# EAGLE design untitled (EAGLE 9.6.2)
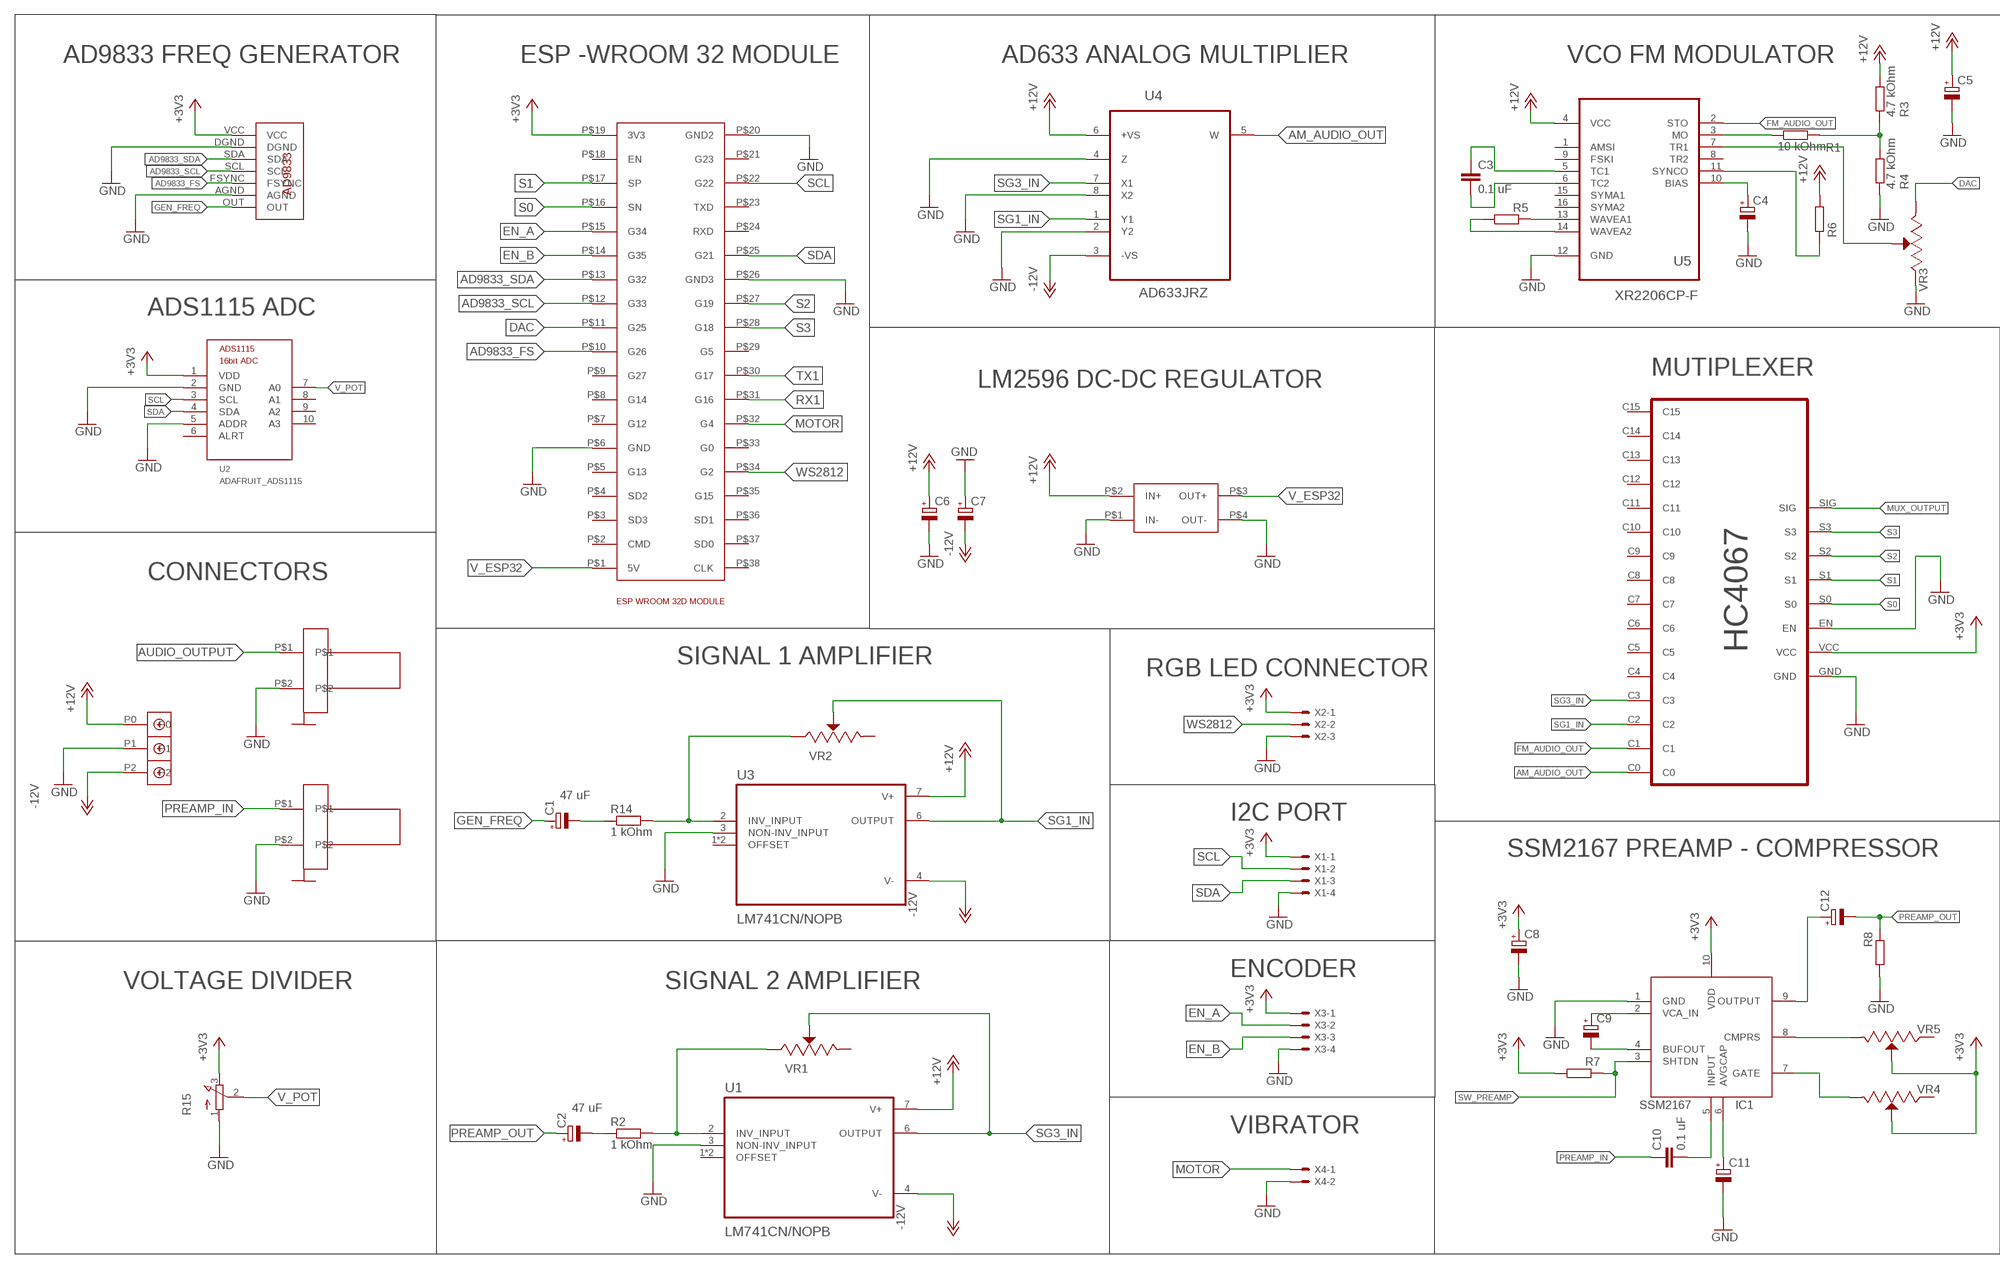
[diagram p0: schematic, sheet 1, part 1 of 2]
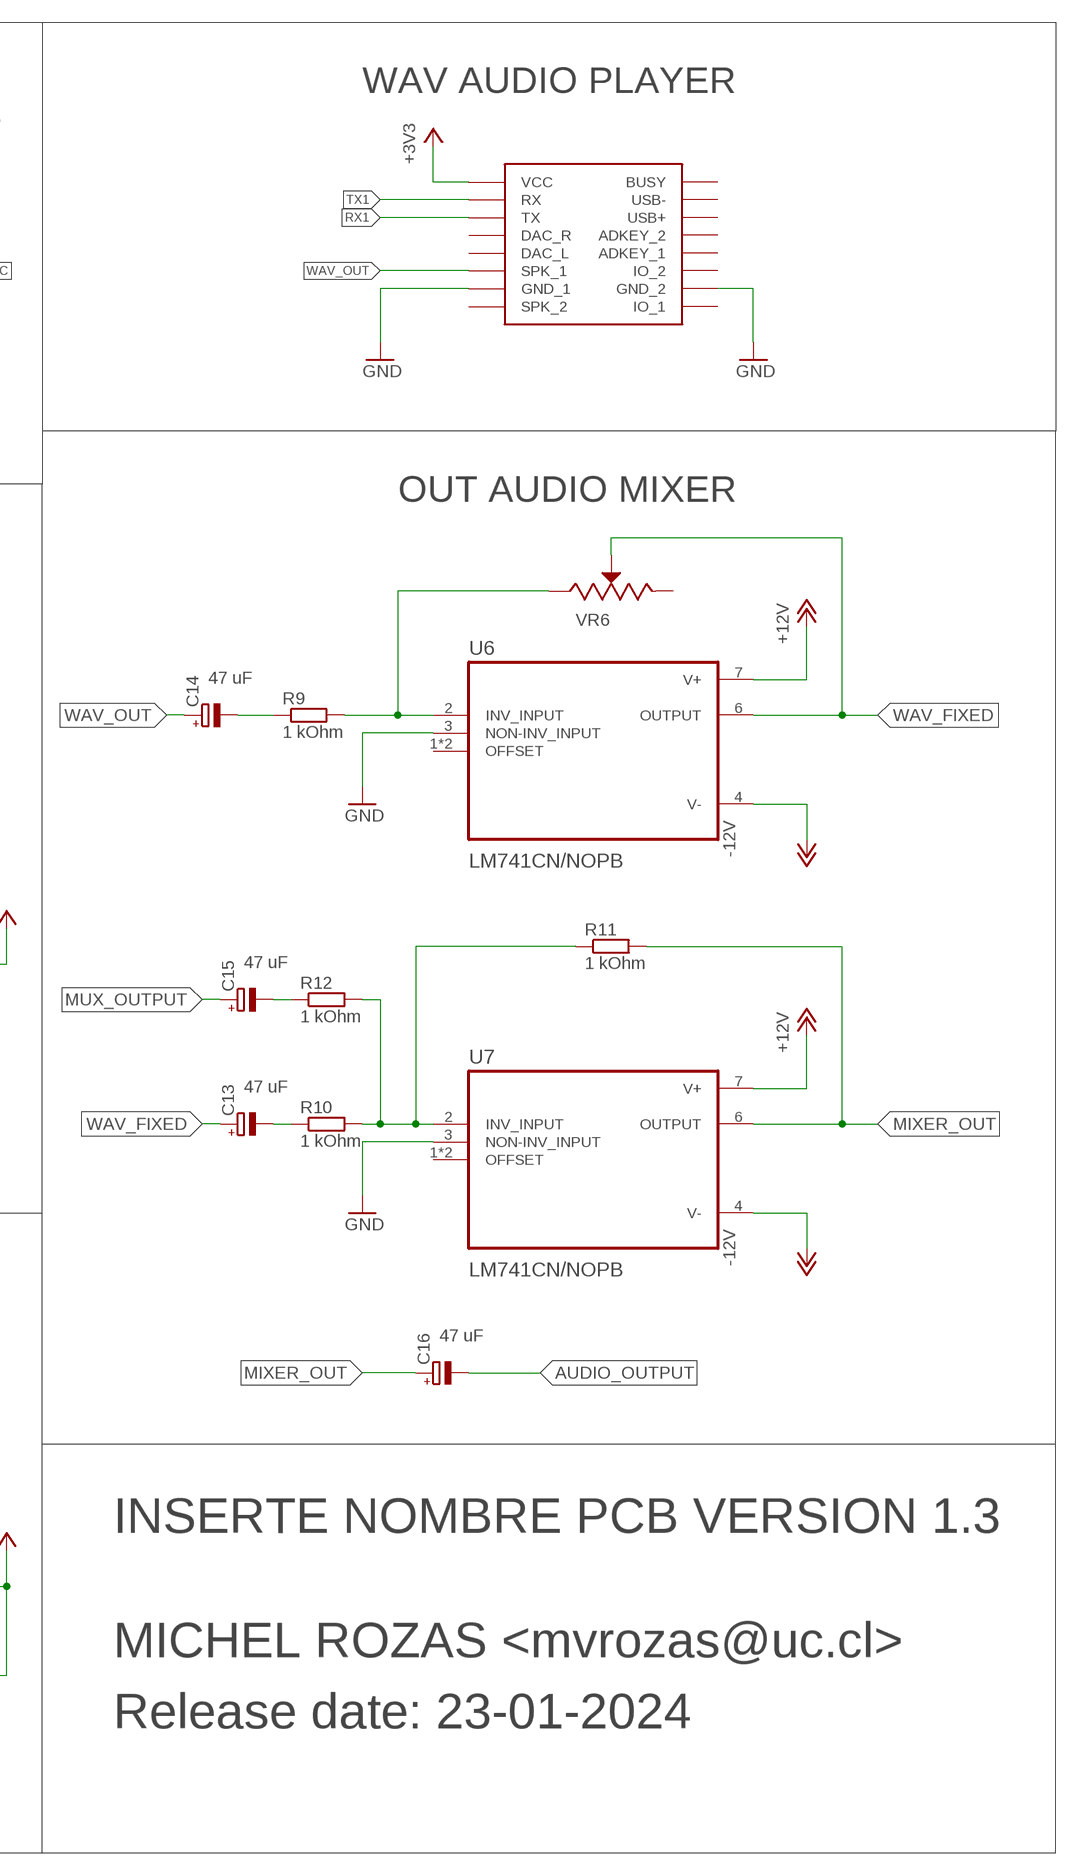
[diagram p1: schematic, sheet 1, part 2 of 2]

## Parts
C1  47 uF  CPOL-EUE1.8-4  [E1,8-4]
C2  47 uF  CPOL-EUE1.8-4  [E1,8-4]
C3  0.1 uF  C-EU050-030X075  [C050-030X075]
C4  1 uF  CPOL-EUE1.8-4  [E1,8-4]
C5  1 uF  CPOL-EUE1.8-4  [E1,8-4]
C6  100 uF  CPOL-EUE1.8-4  [E1,8-4]
C7  100 uF  CPOL-EUE1.8-4  [E1,8-4]
C8  10 uF  CPOL-EUE1.8-4  [E1,8-4]
C9  10 uF  CPOL-EUE1.8-4  [E1,8-4]
C10  0.1 uF  C-EU050-030X075  [C050-030X075]
C11  10 uF  CPOL-EUE1.8-4  [E1,8-4]
C12  10 uF  CPOL-EUE1.8-4  [E1,8-4]
C13  47 uF  CPOL-EUE1.8-4  [E1,8-4]
C14  47 uF  CPOL-EUE1.8-4  [E1,8-4]
C15  47 uF  CPOL-EUE1.8-4  [E1,8-4]
C16  47 uF  CPOL-EUE1.8-4  [E1,8-4]
IC1  SSM2167  [MSOP10]
R1  10 kOhm  R-EU_0204/7  [0204/7]
R2  1 kOhm  R-EU_0204/7  [0204/7]
R3  4.7 kOhm  R-EU_0204/7  [0204/7]
R4  4.7 kOhm  R-EU_0204/7  [0204/7]
R5  200 Ohm  R-EU_0204/7  [0204/7]
R6  10 kOhm  R-EU_0204/7  [0204/7]
R7  500 kOhm  R-EU_0204/7  [0204/7]
R8  100 kOhm  R-EU_0204/7  [0204/7]
R9  1 kOhm  R-EU_0204/7  [0204/7]
R10  1 kOhm  R-EU_0204/7  [0204/7]
R11  1 kOhm  R-EU_0204/7  [0204/7]
R12  1 kOhm  R-EU_0204/7  [0204/7]
R14  1 kOhm  R-EU_0204/7  [0204/7]
R15  3RP/1610N  [3RP/1610N]
U1  LM741CN/NOPB  [DIP794W45P254L959H508Q8]
U2  ADAFRUIT_ADS1115  [ADAFRUIT_ADS1115_16BIT_I2C_ADC]
U3  LM741CN/NOPB  [DIP794W45P254L959H508Q8]
U4  AD633JRZ  [SOIC127P600X175-8N]
U5  XR2206CP-F  [DIP254P762X533-16]
U6  LM741CN/NOPB  [DIP794W45P254L959H508Q8]
U7  LM741CN/NOPB  [DIP794W45P254L959H508Q8]
U$1  ESP32  [ESP32]
U$2  A9833  [AD9833]
U$3  LM2596  [LM2596]
U$4  DBCONN-1X3  [DBCONN-1X3]
U$5  HC4067_BREAKOUT_BOARD  [ANALOG_MUX_BREAKOUT_HC4067]
U$6  FP  [FP]
U$7  FP  [FP]
U$8  DFPLAYER  [DFPLAYER]
VR1  3296W-1-104LF  [TRIM_3296W-1-104LF]
VR2  3296W-1-104LF  [TRIM_3296W-1-104LF]
VR3  3296W-1-104LF  [TRIM_3296W-1-104LF]
VR4  3296W-1-104LF  [TRIM_3296W-1-104LF]
VR5  3296W-1-104LF  [TRIM_3296W-1-104LF]
VR6  3296W-1-104LF  [TRIM_3296W-1-104LF]
X1  JST-XH-04-PIN-ROUND-PAD  [JST-XH-04-PACKAGE-ROUND-PAD]
X2  JST-XH-03-PIN-ROUND-PAD  [JST-XH-03-PACKAGE-ROUND-PAD]
X3  JST-XH-04-PIN-ROUND-PAD  [JST-XH-04-PACKAGE-ROUND-PAD]
X4  JST-XH-02-PIN-ROUND-PAD  [JST-XH-02-PACKAGE-ROUND-PAD]

## Nets
+3V3: C8.+ IC1.10(VDD) R7.1 R15.3(E) U2.1(VDD) U$1.P$19(3V3) U$2.VCC U$5.VCC U$8.VCC VR4.2(WIPER) VR5.2(WIPER) X1.1 X2.1 X3.1
+12V: C5.+ C6.+ R3.2 R6.2 U1.7(V+) U3.7(V+) U4.6(+VS) U5.4(VCC) U6.7(V+) U7.7(V+) U$3.P$2(IN+) U$4.P0
-12V: C7.- U1.4(V-) U3.4(V-) U4.3(-VS) U6.4(V-) U7.4(V-) U$4.P2
AD9833_FS: U$1.P$10(G26) U$2.FSYNC
AD9833_SCL: U$1.P$12(G33) U$2.SCL
AD9833_SDA: U$1.P$13(G32) U$2.SDA
AM_AUDIO_OUT: U4.5(W) U$5.C0
AUDIO_OUTPUT: C16.- U$6.P$1
DAC: U$1.P$11(G25) VR3.3(CW)
EN_A: U$1.P$15(G34) X3.2
EN_B: U$1.P$14(G35) X3.3
FM_AUDIO_OUT: U5.2(STO) U$5.C1
GEN_FREQ: C1.+ U$2.OUT
GND: C4.- C5.- C6.- C7.+ C8.- C11.- IC1.1(GND) R4.1 R8.1 R15.1(A) U1.3(NON-INV_INPUT) U2.2(GND) U2.5(ADDR) U3.3(NON-INV_INPUT) U4.2(Y2) U4.4(Z) U4.8(X2) U5.12(GND) U6.3(NON-INV_INPUT) U7.3(NON-INV_INPUT) U$1.P$6(GND) U$1.P$20(GND2) U$1.P$26(GND3) U$2.AGND U$2.DGND U$3.P$1(IN-) U$4.P1 U$5.EN U$6.P$2 U$7.P$2 U$8.GND_1 U$8.GND_2 VR3.1(CCW) X1.4 X2.3 X3.4 X4.2
MIXER_OUT: C16.+ R11.2 U7.6(OUTPUT)
MOTOR: U$1.P$32(G4) X4.1
MUX_OUTPUT: C15.+ U$5.SIG
N$1: R2.2 U1.2(INV_INPUT) VR1.1(CCW)
N$2: C2.- R2.1
N$3: R1.1 U5.3(MO)
N$4: R14.2 U3.2(INV_INPUT) VR2.1(CCW)
N$5: C1.- R14.1
N$6: R1.2 R3.1 R4.2
N$7: C3.1 U5.5(TC1)
N$8: C3.2 U5.6(TC2)
N$9: U5.7(TR1) VR3.2(WIPER)
N$10: R5.2 U5.13(WAVEA1)
N$11: R5.1 U5.14(WAVEA2)
N$12: R6.1 U5.11(SYNCO)
N$13: C4.+ U5.10(BIAS)
N$14: U$5.GND ; supply symbol labelled GND
N$15: U$3.P$4(OUT-) ; supply symbol labelled GND
N$16: C10.2 IC1.5(INPUT)
N$17: C9.+ IC1.2(VCA_IN)
N$18: C9.- IC1.4(BUFOUT)
N$19: C11.+ IC1.6(AVGCAP)
N$20: IC1.8(CMPRS) VR5.3(CW)
N$21: IC1.7(GATE) VR4.3(CW)
N$22: C12.+ IC1.9(OUTPUT)
N$23: R9.2 U6.2(INV_INPUT) VR6.1(CCW)
N$24: C14.- R9.1
N$25: R10.2 R11.1 R12.2 U7.2(INV_INPUT)
N$26: C13.- R10.1
N$28: C15.- R12.1
PREAMP_IN: C10.1 U$7.P$1
PREAMP_OUT: C2.+ C12.- R8.2
RX1: U$1.P$31(G16) U$8.TX
S0: U$1.P$16(SN) U$5.S0
S1: U$1.P$17(SP) U$5.S1
S2: U$1.P$27(G19) U$5.S2
S3: U$1.P$28(G18) U$5.S3
SCL: U2.3(SCL) U$1.P$22(G22) X1.2
SDA: U2.4(SDA) U$1.P$25(G21) X1.3
SG1_IN: U3.6(OUTPUT) U4.1(Y1) U$5.C2 VR2.2(WIPER)
SG3_IN: U1.6(OUTPUT) U4.7(X1) U$5.C3 VR1.2(WIPER)
SW_PREAMP: IC1.3(SHTDN) R7.2
TX1: U$1.P$30(G17) U$8.RX
V_ESP32: U$1.P$1(5V) U$3.P$3(OUT+)
V_POT: R15.2(S) U2.7(A0)
WAV_FIXED: C13.+ U6.6(OUTPUT) VR6.2(WIPER)
WAV_OUT: C14.+ U$8.SPK1(SPK_1)
WS2812: U$1.P$34(G2) X2.2
Unconnected: U1.1(OFFSET) U1.5(OFFSET) U2.6(ALRT) U2.8(A1) U2.9(A2) U2.10(A3) U3.1(OFFSET) U3.5(OFFSET) U5.1(AMSI) U5.8(TR2) U5.9(FSKI) U5.15(SYMA1) U5.16(SYMA2) U6.1(OFFSET) U6.5(OFFSET) U7.1(OFFSET) U7.5(OFFSET) U$1.P$2(CMD) U$1.P$3(SD3) U$1.P$4(SD2) U$1.P$5(G13) U$1.P$7(G12) U$1.P$8(G14) U$1.P$9(G27) U$1.P$18(EN) U$1.P$21(G23) U$1.P$23(TXD) U$1.P$24(RXD) U$1.P$29(G5) U$1.P$33(G0) U$1.P$35(G15) U$1.P$36(SD1) U$1.P$37(SD0) U$1.P$38(CLK) U$5.C4 U$5.C5 U$5.C6 U$5.C7 U$5.C8 U$5.C9 U$5.C10 U$5.C11 U$5.C12 U$5.C13 U$5.C14 U$5.C15 U$8.ADKEY1(ADKEY_1) U$8.ADKEY2(ADKEY_2) U$8.BUSY U$8.DAC_L U$8.DAC_R U$8.IO1(IO_1) U$8.IO2(IO_2) U$8.SPK2(SPK_2) U$8.USB+ U$8.USB- VR1.3(CW) VR2.3(CW) VR4.1(CCW) VR5.1(CCW) VR6.3(CW)

## Notes on the sheet
- AD9833 FREQ GENERATOR | ESP -WROOM 32 MODULE | AD633 ANALOG MULTIPLIER | VCO FM MODULATOR | WAV AUDIO PLAYER
- ADS1115 ADC
- OUT AUDIO MIXER
- MUTIPLEXER
- LM2596 DC-DC REGULATOR
- CONNECTORS
- SIGNAL 1 AMPLIFIER
- RGB LED CONNECTOR
- I2C PORT
- SSM2167 PREAMP - COMPRESSOR
- ENCODER
- VOLTAGE DIVIDER | SIGNAL 2 AMPLIFIER
- INSERTE NOMBRE PCB VERSION 1.3
- MICHEL ROZAS <mvrozas@uc.cl>
- VIBRATOR
- Release date: 23-01-2024

## Library data of the parts
C1 C2 C4-C9 C11-C16 = rcl:CPOL-EU: POLARIZED CAPACITOR, European symbol; SPICEPREFIX: C
C3 C10 = rcl:C-EU: CAPACITOR, European symbol; SPICEPREFIX: C
IC1 = SSM2167:SSM2167: SSM2167 Microphone conditioner chip Check availability <https://pricing.snapeda.com/parts/SSM2167/Analog%20Devices/view-part?ref=eda>; AVAILABILITY: In Stock; CHECK_PRICES: https://www.snapeda.com/parts/SSM2167/Analog+Devices/view-part/?ref=eda; DESCRIPTION: Amplifier IC 1-Channel (Mono) Class AB 10-MSOP; MF: Analog Devices; MP: SSM2167; PACKAGE: MSOP-10 Analog Devices; PRICE: None; SNAPEDA_LINK: https://www.snapeda.com/parts/SSM2167/Analog+Devices/view-part/?ref=snap
R1-R12 R14 = rcl:R-EU_: RESISTOR, European symbol; SPICEPREFIX: R
R15 = pot:3RP/1610N: 16mm Potentiometer one level Source: http://www.alphapotentiometers.net/html/16mm_pot_2.html
U1 U3 U6 U7 = LM741CN_NOPB:LM741CN/NOPB: Check availability <https://pricing.snapeda.com/parts/LM741CN/Texas%20Instruments/view-part?ref=eda>; AVAILABILITY: In Stock; DESCRIPTION: Operational Amplifiers - Op Amps Operational Amplifier 8-PDIP 0 to 70; MF: Texas Instruments; MP: LM741CN; PACKAGE: DIP-8 NXP Semiconductors; PRICE: None; PURCHASE-URL: https://pricing.snapeda.com/search?q=LM741CN&ref=eda
U2 = ADS1115:ADAFRUIT_ADS1115
U4 = AD633JRZ:AD633JRZ: Analog Multiplier Check availability <https://pricing.snapeda.com/parts/AD633JRZ/Analog%20Devices/view-part?ref=eda>; AVAILABILITY: In Stock; CHECK_PRICES: https://www.snapeda.com/parts/AD633JRZ/Analog+Devices/view-part/?ref=eda; DESCRIPTION: Low Cost Analog Multiplier; MF: Analog Devices; MP: AD633JRZ; PACKAGE: SOIC-8 Analog Devices; PRICE: None; PURCHASE-URL: https://www.snapeda.com/api/url_track_click_mouser/?unipart_id=7529&manufacturer=Analog Devices&part_name=AD633JRZ&search_term=None; SNAPEDA_LINK: https://www.snapeda.com/parts/AD633JRZ/Analog+Devices/view-part/?ref=snap
U5 = XR2206CP-F:XR2206CP-F: Monolithic Function Generator Check availability <https://pricing.snapeda.com/parts/XR2206CP-F/MaxLinear%2C%20Inc./view-part?ref=eda>; AVAILABILITY: In Stock; CHECK_PRICES: https://www.snapeda.com/parts/XR2206CP-F/MaxLinear%252C+Inc./view-part/?ref=eda; DESCRIPTION: Function Generator IC 1MHz 1 16-DIP (0.300, 7.62mm); MF: MaxLinear, Inc.; MP: XR2206CP-F; PACKAGE: PDIP-16 Exar; PRICE: None; PURCHASE-URL: https://www.snapeda.com/api/url_track_click_mouser/?unipart_id=35701&manufacturer=MaxLinear, Inc.&part_name=XR2206CP-F&search_term=xr2206; SNAPEDA_LINK: https://www.snapeda.com/parts/XR2206CP-F/MaxLinear%252C+Inc./view-part/?ref=snap
U$1 = [module]ESP32:ESP32
U$2 = AD9833:A9833
U$3 = lm2596 MODULE:LM2596
U$4 = Terminal Block Connector:DBCONN-1X3
U$5 = HC4067_breakout_board:HC4067_BREAKOUT_BOARD
U$6 U$7 = AUDIO MONO:FP
U$8 = DFPlayer_v1:DFPLAYER
VR1-VR6 = 3296W-1-104LF:3296W-1-104LF: Res Cermet Trimmer 500K Ohm 10% 0.5W 25(Elec)Turn 2.19mm (9.53 X 4.83 X 11.55mm) Pin Thru-Hole Tube Check availability <https://pricing.snapeda.com/parts/3296W-1-104LF/Bourns/view-part?ref=eda>; AVAILABILITY: In Stock; CHECK_PRICES: https://www.snapeda.com/parts/3296W-1-104LF/Bourns/view-part/?ref=eda; DESCRIPTION: Trimmer, Cermet, Rest 100 Kilohms, PCB, 25 Turns, Pwr-Rtg 0.5W, 3296 Series | Bourns 3296W-1-104LF; MF: Bourns; MP: 3296W-1-104LF; PACKAGE: NON STANDARD-3 Bourns; PRICE: None; PURCHASE-URL: https://www.snapeda.com/api/url_track_click_mouser/?unipart_id=8100&manufacturer=Bourns&part_name=3296W-1-104LF&search_term=None; SNAPEDA_LINK: https://www.snapeda.com/parts/3296W-1-104LF/Bourns/view-part/?ref=snap
X1 X3 = [MODULE] JST XH 2MM:JST-XH-04-PIN: JST XH Connector 2 Pin Wire to board connector. Pitch: 2,54 mm, (0.100") Number of pins: 4 Created by Rembrandt Electronics www.rembrandtelectronics.com
X2 = [MODULE] JST XH 2MM:JST-XH-03-PIN: JST XH Connector 2 Pin Wire to board connector. Pitch: 2,54 mm, (0.100") Number of pins: 3 Created by Rembrandt Electronics www.rembrandtelectronics.com
X4 = [MODULE] JST XH 2MM:JST-XH-02-PIN: JST XH Connector 2 Pin Wire to board connector. Pitch: 2,54 mm, (0.100") Number of pins: 2 Created by Rembrandt Electronics www.rembrandtelectronics.com

## Board
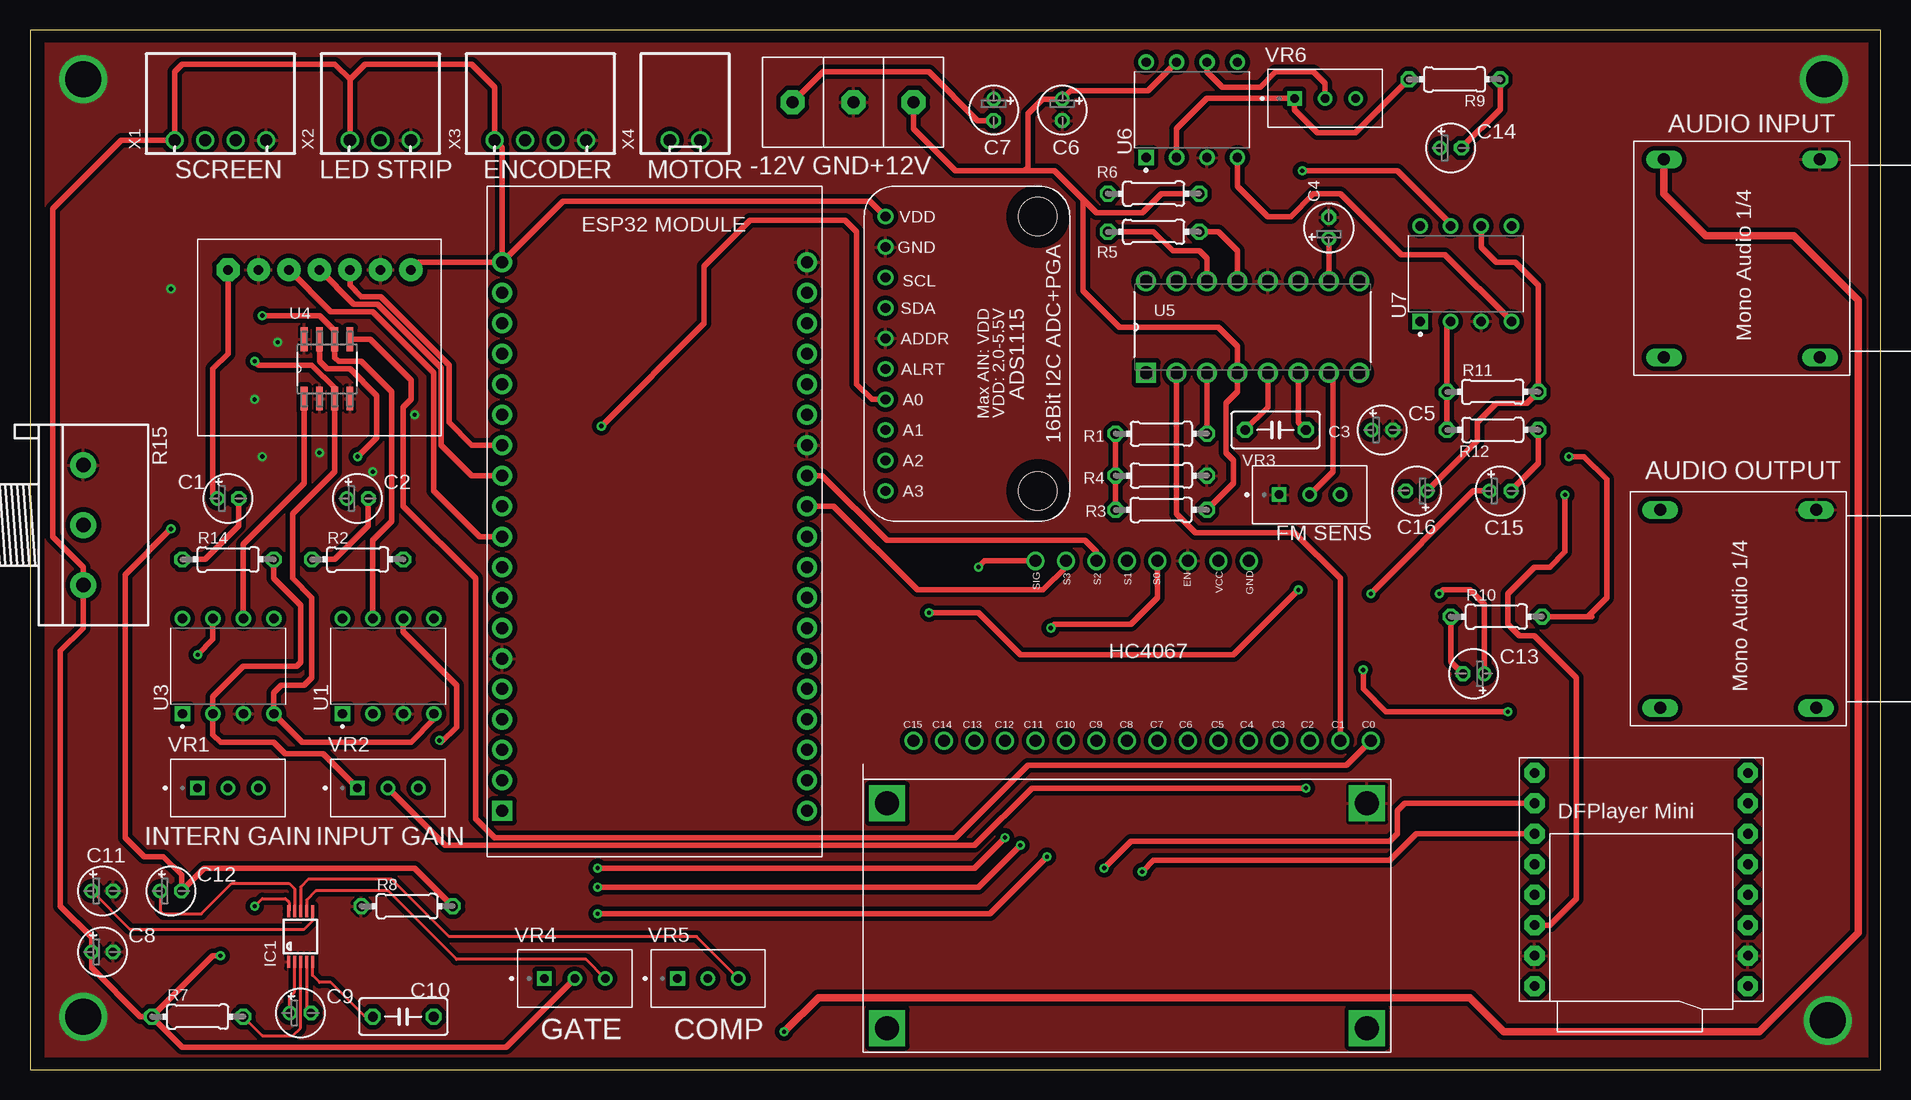
[diagram p2: board, top side]
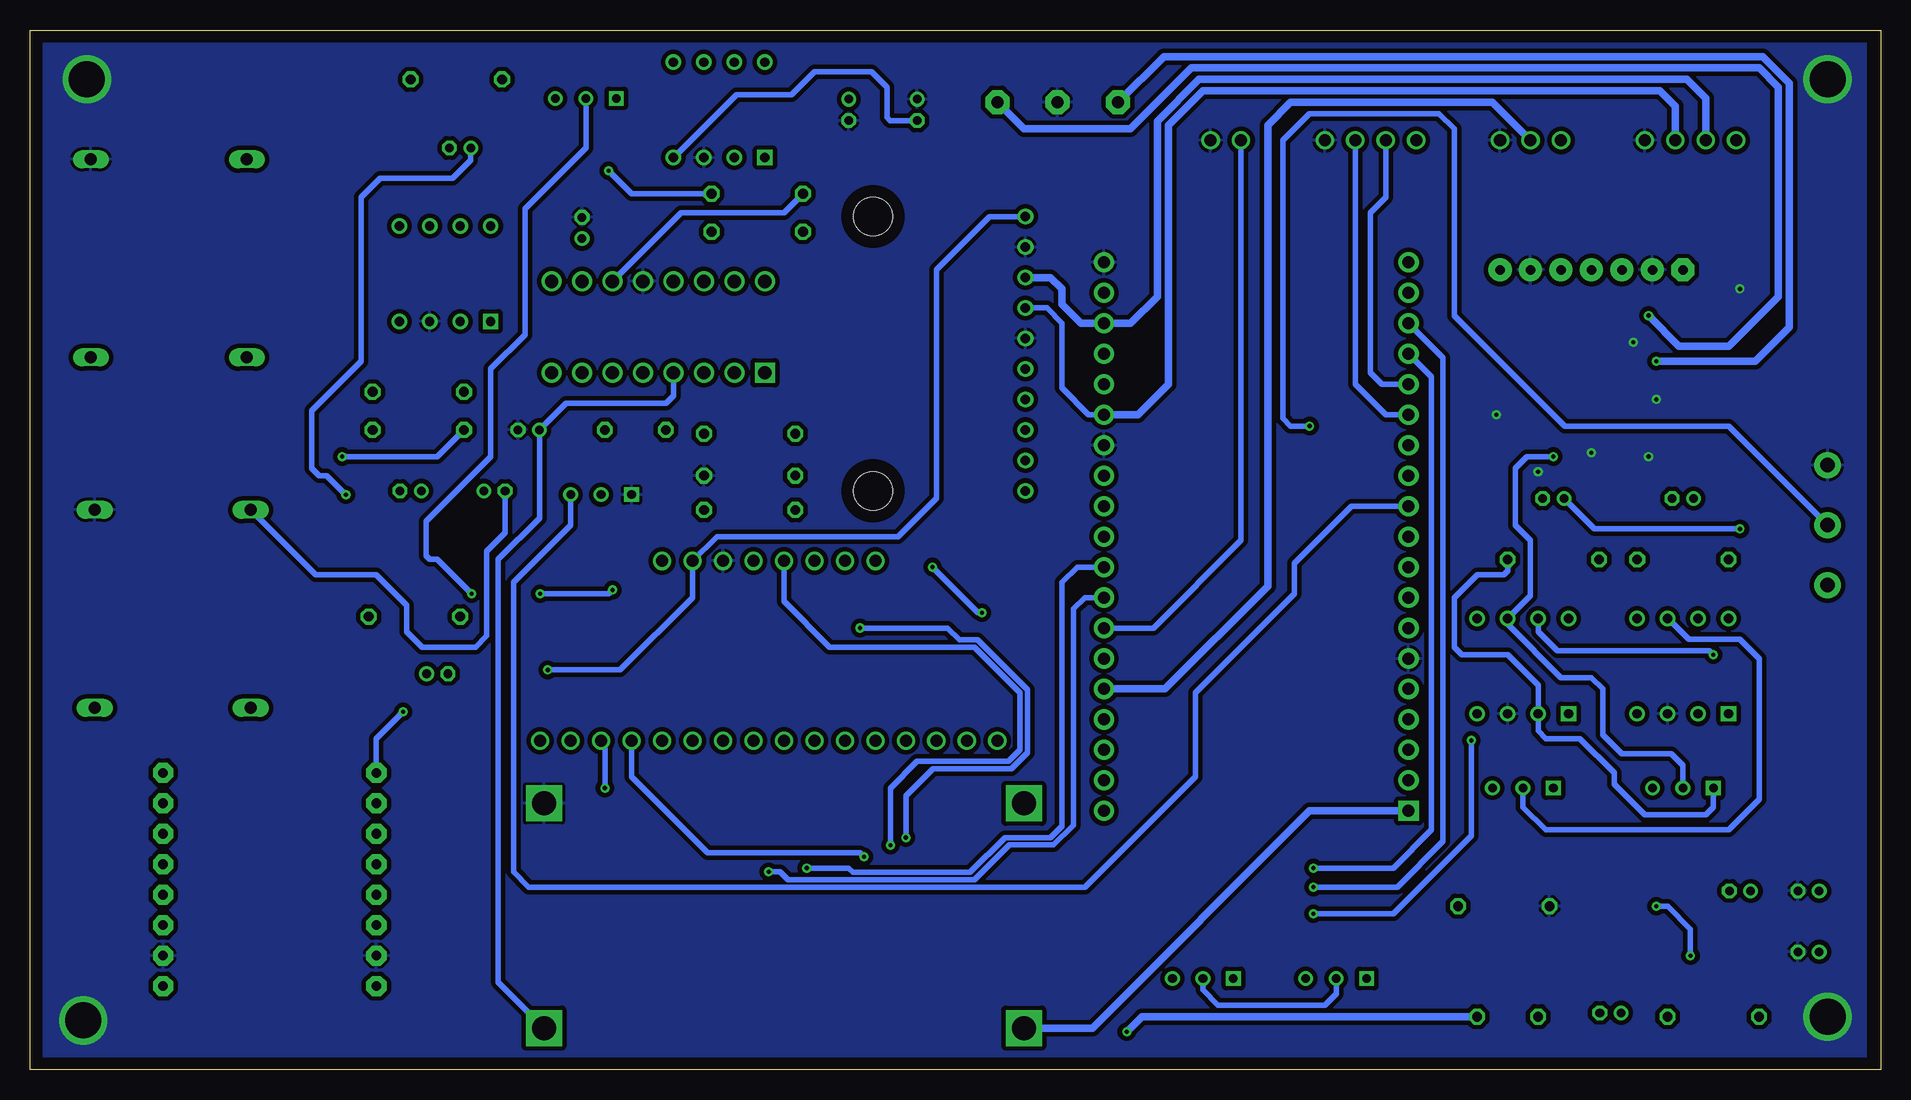
[diagram p3: board, bottom side, seen from below]

Size 154.28 x 86.66 mm. Coordinates in mm from the lower left corner, seen from the top.
Outline: 0,0 154.28,0 154.28,86.66 0,86.66 0,0
Copper layers (1*16): Top 0.035mm / dielectric 1.5mm / Bottom 0.035mm
Design rules "default": minimum track width 6mil, minimum drill 0.35mm, track to track 6mil, track to pad 6mil, pad to pad 6mil, via to via 6mil, smd to smd 6mil, copper to edge 40mil, drill to drill 6mil, minimum pad ring 10mil, minimum via ring 8mil, stop-mask expansion 4mil, vias tented up to drill 0mil, thermal gap 10mil

### Footprints (pad centres in the part's own frame; a part is rotated, then mirrored left to right if it is on the bottom)
E1,8-4 = drill 0.711 pad 1.168: + -0.889,0 | drill 0.711 pad 1.168 octagon: - 0.889,0
C050-030X075 = drill 0.813 octagon: 1 -2.54,0; 2 2.54,0
MSOP10 = smd 0.25 x 1: 1 -1,-2.113; 2 -0.5,-2.113; 3 0,-2.113; 4 0.5,-2.113; 5 1,-2.113; 6 1,2.113; 7 0.5,2.113; 8 0,2.113; 9 -0.5,2.113; 10 -1,2.113
0204/7 = drill 0.813 octagon: 1 -3.81,0; 2 3.81,0
3RP/1610N = drill 1.2 pad 2.184: 1 -5,0; 2 0,0; 3 5,0
DIP794W45P254L959H508Q8 = drill 0.78 pad 1.13 square: 1 -3.97,3.81 | drill 0.78 pad 1.13: 2 -3.97,1.27; 3 -3.97,-1.27; 4 -3.97,-3.81; 5 3.97,-3.81; 6 3.97,-1.27; 7 3.97,1.27; 8 3.97,3.81
ADAFRUIT_ADS1115_16BIT_I2C_ADC = drill 0.8: 1 2.54,1.778; 2 5.08,1.778; 3 7.62,1.778; 4 10.16,1.778; 5 12.7,1.778; 6 15.24,1.778; 7 17.78,1.778; 8 20.32,1.778; 9 22.86,1.778; 10 25.4,1.778 | hole 3.2: 2.54,14.478; 25.4,14.478
SOIC127P600X175-8N = smd 1.981 x 0.559: 1 -2.464,1.905; 2 -2.464,0.635; 3 -2.464,-0.635; 4 -2.464,-1.905; 5 2.464,-1.905; 6 2.464,-0.635; 7 2.464,0.635; 8 2.464,1.905
DIP254P762X533-16 = drill 1.118 square: 1 -7.62,17.78 | drill 1.118: 2 -7.62,15.24; 3 -7.62,12.7; 4 -7.62,10.16; 5 -7.62,7.62; 6 -7.62,5.08; 7 -7.62,2.54; 8 -7.62,0; 9 0,0; 10 0,2.54; 11 0,5.08; 12 0,7.62; 13 0,10.16; 14 0,12.7; 15 0,15.24; 16 0,17.78
ESP32 = drill 1 pad 1.676 square: P$1 1.27,3.81 | drill 1 pad 1.676: P$2 1.27,6.35; P$3 1.27,8.89; P$4 1.27,11.43; P$5 1.27,13.97; P$6 1.27,16.51; P$7 1.27,19.05; P$8 1.27,21.59; P$9 1.27,24.13; P$10 1.27,26.67; P$11 1.27,29.21; P$12 1.27,31.75; P$13 1.27,34.29; P$14 1.27,36.83; P$15 1.27,39.37; P$16 1.27,41.91; P$17 1.27,44.45; P$18 1.27,46.99; P$19 1.27,49.53; P$20 26.67,49.53; P$21 26.67,46.99; P$22 26.67,44.45; P$23 26.67,41.91; P$24 26.67,39.37; P$25 26.67,36.83; P$26 26.67,34.29; P$27 26.67,31.75; P$28 26.67,29.21; P$29 26.67,26.67; P$30 26.67,24.13; P$31 26.67,21.59; P$32 26.67,19.05; P$33 26.67,16.51; P$34 26.67,13.97; P$35 26.67,11.43; P$36 26.67,8.89; P$37 26.67,6.35; P$38 26.67,3.81
AD9833 = drill 0.8 pad 1.93: AGND 0,2.54; DGND 0,12.7; FSYNC 0,5.08; SCL 0,7.62; SDA 0,10.16; VCC 0,15.24 | drill 0.8 pad 1.93 octagon: OUT 0,0
LM2596 = drill 2 pad 2.54 square: P$1 0,0; P$2 0,18.73; P$3 40,18.73; P$4 40,0
DBCONN-1X3 = drill 1 pad 2 octagon: P0 2.54,3.81; P1 7.54,3.81; P2 12.62,3.81
ANALOG_MUX_BREAKOUT_HC4067 = drill 1: C0 19.05,-7.493; C1 16.51,-7.493; C2 13.97,-7.493; C3 11.43,-7.493; C4 8.89,-7.493; C5 6.35,-7.493; C6 3.81,-7.493; C7 1.27,-7.493; C8 -1.27,-7.493; C9 -3.81,-7.493; C10 -6.35,-7.493; C11 -8.89,-7.493; C12 -11.43,-7.493; C13 -13.97,-7.493; C14 -16.51,-7.493; C15 -19.05,-7.493; EN 3.81,7.493; GND 8.89,7.493; S0 1.27,7.493; S1 -1.27,7.493; S2 -3.81,7.493; S3 -6.35,7.493; SIG -8.89,7.493; VCC 6.35,7.493
FP = drill 1 long: P$1 0,0; P$2 0,13; P$3 16.5,13; P$4 16.5,0
DFPLAYER = drill 0.8 pad 1.676 octagon: ADKEY1 8.89,-1.27; ADKEY2 8.89,1.27; BUSY 8.89,8.89; DAC_L -8.89,-1.27; DAC_R -8.89,1.27; GND_1 -8.89,-6.35; GND_2 8.89,-6.35; IO1 8.89,-8.89; IO2 8.89,-3.81; RX -8.89,6.35; SPK1 -8.89,-3.81; SPK2 -8.89,-8.89; TX -8.89,3.81; USB+ 8.89,3.81; USB- 8.89,6.35; VCC -8.89,8.89
TRIM_3296W-1-104LF = drill 0.71 square: 1 -2.54,0 | drill 0.71: 2 0,0; 3 2.54,0
JST-XH-04-PACKAGE-ROUND-PAD = drill 1.016: 1 -3.81,-1.27; 2 -1.27,-1.27; 3 1.27,-1.27; 4 3.81,-1.27
JST-XH-03-PACKAGE-ROUND-PAD = drill 1.016: 1 -2.54,-1.27; 2 0,-1.27; 3 2.54,-1.27
JST-XH-02-PACKAGE-ROUND-PAD = drill 1.016: 1 -1.27,-1.27; 2 1.27,-1.27

### Placement (x,y rotation side)
C1  16.51,47.62 0 top
C2  27.3,47.62 0 top
C3  103.82,53.34 0 top
C4  108.27,70.17 90 top
C5  112.71,53.34 0 top
C6  86.04,80.01 270 top
C7  80.33,80.01 270 top
C8  6.03,9.84 0 top
C9  22.54,4.76 0 top
C10  31.11,4.45 180 top
C11  6.03,14.92 0 top
C12  11.75,14.92 0 top
C13  120.33,33.02 180 top
C14  118.43,76.84 0 top
C15  122.56,48.26 0 top
C16  115.57,48.26 180 top
IC1  22.54,11.11 0 top
R1  94.3,53.02 180 top
R2  27.3,42.55 0 top
R3  94.3,46.67 0 top
R4  94.3,49.53 180 top
R5  93.66,69.85 0 top
R6  93.66,73.03 0 top
R7  13.97,4.45 0 top
R8  31.43,13.65 0 top
R9  118.75,82.55 180 top
R10  122.24,37.78 0 top
R11  121.92,56.51 0 top
R12  121.92,53.34 180 top
R14  16.51,42.55 0 top
R15  4.45,45.4 270 top
U1  29.84,33.66 90 top
U2  69.53,73.66 270 top
U3  16.51,33.66 90 top
U4  24.77,58.42 90 top
U5  110.81,65.72 90 top
U6  96.84,80.01 90 top
U7  119.7,66.36 90 top
U$1  38.1,17.78 0 top
U$2  16.51,66.68 270 top
U$3  111.44,22.23 180 top
U$4  76.2,84.46 180 top
U$5  92.71,34.92 0 top
U$6  135.89,46.67 270 top
U$7  136.21,75.88 270 top
U$8  134.3,15.88 0 top
VR1  16.51,23.49 0 top
VR2  29.84,23.49 0 top
VR3  106.68,47.94 0 top
VR4  45.4,7.62 0 top
VR5  56.52,7.62 0 top
VR6  107.95,80.96 0 top
X1  15.88,78.74 0 top
X2  29.21,78.74 0 top
X3  42.55,78.74 0 top
X4  54.61,78.74 0 top

### Tracks (layer width: path | path; a pad name or v marks a point on that pad's centre or on a via)
+3V3  (via drill 0.35)
  Top 0.254: v18.73,13.65 19.37,14.29 21.27,14.29 21.59,13.97 21.59,13.27 IC1.10
  Top 0.457: 26.67,82.55 25.4,83.82 12.7,83.82 12.06,83.19 X1.1 7.62,77.47 1.91,71.75 1.91,44.45 4.45,41.91 R15.3 4.45,36.83 2.54,34.92 2.54,13.65 5.14,11.05 C8.+ 5.14,8.51 9.21,4.45 R7.1 | X2.1 26.67,82.55 | 26.67,82.55 27.94,83.82 36.83,83.82 38.73,81.91 X3.1 39.37,76.84 U$1.P$19 | U$2.VCC 32.38,67.31 U$1.P$19 | U$1.P$19 44.45,72.39 70.04,72.39 U2.1 | VR4.2 39.69,1.9 12.7,1.9 R7.1 | R7.1 15.24,9.52 v15.88,9.52 | v123.19,29.84 113.03,29.84 111.12,31.75 v111.12,33.34
  Bottom 0.457: U2.1 74.3,71.12 78.74,66.68 78.74,47.62 81.92,44.45 97.03,44.45 U$5.VCC 99.06,39.37 105.09,33.34 v111.12,33.34 | v15.88,9.52 15.88,11.75 17.78,13.65 v18.73,13.65 | VR4.2 45.4,6.35 46.35,5.4 55.24,5.4 56.52,6.67 VR5.2 | v123.19,29.84 125.41,27.62 U$8.VCC
+12V  (via drill 0.35)
  Top 0.457: U3.7 15.24,35.88 v13.97,34.61 | U1.7 28.57,44.13 30.16,45.72 30.16,56.51 27.62,59.05 25.72,59.05 25.4,59.37 U4.6 25.4,61.6 24.13,62.87 v19.37,62.87 | R3.2 100.33,48.89 100.33,50.8 99.69,51.43 99.69,55.56 100.65,56.51 U5.4 100.65,60.32 99.06,61.91 90.81,61.91 87.79,64.93 87.79,72.55 | R6.2 94.3,73.03 92.71,71.44 88.9,71.44 87.79,72.55 | 82.87,74.93 85.41,74.93 87.79,72.55 | 82.87,74.93 83.19,75.25 83.19,79.69 84.39,80.9 C6.+ 86.74,81.6 93.19,81.6 U6.7 | U$4.P0 73.66,78.42 77.15,74.93 82.87,74.93 | v106.05,74.93 113.98,74.93 118.43,70.48 U7.7
  Bottom 0.457: v13.97,34.61 14.29,34.92 26.99,34.92 28.57,36.51 U1.7 | U5.4 100.65,56.2 101.28,55.56 109.6,55.56 C5.+ 111.82,45.97 115.25,42.55 115.25,7.3 U$3.P$2 | R6.2 104.14,73.03 v106.05,74.93
  Bottom 0.61: U$4.P0 71.44,78.42 62.55,78.42 57.47,83.5 10.16,83.5 8.57,81.91 8.57,64.45 12.7,60.32 16.83,60.32 v19.37,62.87
-12V  (via drill 0.35)
  Top 0.457: U1.4 33.66,29.21 31.75,27.3 22.7,27.3 U3.4 20.32,31.43 20.95,32.07 22.86,32.07 23.5,32.7 23.5,39.37 21.91,40.96 21.91,46.35 25.4,49.85 U4.3 25.4,56.83 23.5,58.74 19.05,58.74 v18.73,59.05 | U$4.P2 66.12,83.19 74.93,83.19 78.99,79.12 C7.- | U7.4 117.95,67.94 114.3,67.94 109.22,73.03 107,73.03 105.09,71.12 103.19,71.12 100.65,73.66 U6.4
  Bottom 0.457: U6.4 95.41,81.28 90.81,81.28 88.9,83.19 84.14,83.19 82.87,81.91 82.87,79.38 82.61,79.12 C7.-
  Bottom 0.61: U$4.P2 59.77,84.46 9.84,84.46 7.62,82.23 7.62,61.91 10.48,59.05 v18.73,59.05
AD9833_FS
  Top 0.457: U$2.FSYNC 25.08,63.18 28.57,63.18 33.66,58.1 33.66,48.26 37.47,44.45 U$1.P$10
AD9833_SCL
  Top 0.457: U$2.SCL 26.99,63.82 28.98,63.82 34.29,58.51 34.29,52.07 36.83,49.53 U$1.P$12
AD9833_SDA
  Top 0.457: U$2.SDA 26.67,65.41 27.62,64.45 29.21,64.45 34.92,58.74 34.92,53.98 36.83,52.07 U$1.P$13
AM_AUDIO_OUT
  Top 0.457: U4.5 28.33,60.88 31.75,57.47 31.75,55.88 31.11,55.24 31.11,46.99 37.15,40.96 37.15,20.95 38.73,19.37 77.15,19.37 83.19,25.4 109.73,25.4 U$5.C0
AUDIO_OUTPUT
  Bottom 0.457: C16.- 114.68,44.77 116.2,43.24 116.2,36.2 117.16,35.24 121.6,35.24 122.87,36.51 122.87,38.73 125.41,41.27 130.49,41.27 U$6.P$1
DAC
  Bottom 0.457: U$1.P$11 44.13,46.99 48.9,42.23 48.9,39.69 57.15,31.43 57.15,24.45 66.36,15.24 112.71,15.24 113.98,16.51 113.98,40.64 109.22,45.4 VR3.3
EN_A
  Bottom 0.457: X3.2 41.27,72.71 42.55,71.44 42.55,58.1 41.59,57.15 U$1.P$15
EN_B
  Bottom 0.457: X3.3 43.81,57.15 41.27,54.61 U$1.P$14
FM_AUDIO_OUT
  Top 0.457: U$5.C1 109.22,40.96 105.41,44.77 97.16,44.77 95.57,46.35 U5.2
GEN_FREQ
  Top 0.457: U$2.OUT 16.51,59.69 15.24,58.42 15.24,48.01 C1.+
GND  (via drill 0.35, 3)
  other vias: 149.86,4.13 149.54,82.55 4.45,82.55 4.45,4.45 11.75,65.09 18.73,55.88 32.07,54.61 20.64,60.64 19.37,51.12 24.13,51.43 28.57,49.85
  pour Bottom (isolate 0.381): 1.27,85.72 1.27,0.63 153.99,0.63 153.99,85.72
  pour Top (isolate 0.381): 1.27,85.72 1.27,0.63 153.99,0.63 153.99,85.72
MIXER_OUT
  Top 0.457: U7.6 120.97,68.58 122.24,67.31 123.83,67.31 125.73,65.41 R11.2 124.78,55.56 122.24,55.56 120.65,53.98 120.65,52.45 C16.+
MOTOR
  Bottom 0.457: X4.1 53.34,44.13 60.64,36.83 U$1.P$32
MUX_OUTPUT  (via drill 0.35)
  Top 0.457: U$5.SIG 79.57,42.42 v79.06,41.91 | v74.93,38.1 79.06,38.1 82.55,34.61 100.33,34.61 v105.73,40.01 | C15.+ 120.33,48.26 v111.76,39.69
  Bottom 0.457: v79.06,41.91 75.25,38.1 v74.93,38.1 | v105.73,40.01 106.05,39.69 v111.76,39.69
N$1
  Bottom 0.457: R2.2 31.11,41.59 31.43,41.27 33.66,41.27 35.56,39.37 35.56,35.24 34.92,34.61 31.11,34.61 28.57,32.07 U1.2 28.57,28.26 27.94,27.62 25.08,27.62 22.23,24.77 22.23,23.81 19.68,21.27 14.61,21.27 13.97,21.91 VR1.1
N$2
  Top 0.457: R2.1 25.4,42.55 28.19,45.34 C2.-
N$3
  Top 0.457: R1.1 U5.3
N$4
  Top 0.457: R14.2 20.32,40.96 22.54,38.73 22.54,33.97 22.23,33.66 17.78,33.66 15.24,31.12 U3.2 15.24,27.94 15.88,27.3 20.32,27.3 21.27,26.35 24.45,26.35 VR2.1
N$5
  Top 0.457: C1.- 17.4,45.34 14.61,42.55 R14.1
N$6
  Top 0.457: R1.2 R4.2 R3.1
N$7
  Top 0.457: C3.1 103.19,55.24 U5.5
N$8
  Top 0.457: C3.2 105.73,53.98 U5.6
N$9
  Top 0.457: VR3.2 108.58,49.85 108.58,57.79 U5.7
N$10
  Top 0.457: R5.2 99.06,69.85 100.65,68.26 U5.13
N$11
  Top 0.457: R5.1 93.66,69.85 95.25,68.26 97.47,68.26 98.11,67.63 U5.14
N$12
  Bottom 0.457: U5.11 100.01,71.44 91.44,71.44 R6.1
N$13
  Top 0.457: U5.10 C4.+
N$16
  Top 0.254: C10.2 27.94,4.45 25.08,7.3 24.13,7.3 23.54,7.89 IC1.5
N$17
  Top 0.254: C9.+ 21.65,6.1 22.04,6.48 IC1.2
N$18
  Top 0.254: IC1.4 23.04,5.15 C9.-
N$19
  Top 0.254: C11.+ 8.32,11.75 22.86,11.75 23.54,12.43 IC1.6
N$20
  Top 0.254: VR5.3 55.56,11.11 34.92,11.11 30.16,15.88 23.18,15.88 22.54,15.24 IC1.8
N$21
  Top 0.254: VR4.3 46.35,9.21 35.56,9.21 29.84,14.92 23.81,14.92 23.04,14.15 IC1.7
N$22
  Top 0.254: C12.+ 10.86,13.27 11.11,13.02 14.29,13.02 16.83,15.56 21.59,15.56 22.04,15.11 IC1.9
N$23
  Top 0.457: U6.2 95.57,78.42 98.11,80.96 VR6.1 105.41,80.01 107.31,78.1 110.49,78.1 R9.2
N$24
  Top 0.457: C14.- 122.56,80.07 R9.1
N$25  (via drill 0.35)
  Top 0.457: R12.2 R11.1 118.11,62.07 U7.2 | R10.2 129.86,37.78 | 129.86,37.78 130.18,37.78 | 129.86,37.78 131.44,39.37 131.44,49.21 129.54,51.12 v128.27,51.12
  Bottom 0.457: v128.27,51.12 120.33,51.12 R12.2
N$26
  Top 0.457: C13.- 118.43,34.04 R10.1
N$28
  Top 0.457: C15.- 125.73,50.55 R12.1
PREAMP_IN  (via drill 0.35)
  Top 0.61: v62.87,3.18 65.72,6.03 120.02,6.03 122.87,3.18 144.15,3.18 152.4,11.43 152.4,64.13 147,69.53 139.7,69.53 136.21,73.03 U$7.P$1
  Bottom 0.61: C10.1 61.59,4.45 v62.87,3.18
PREAMP_OUT  (via drill 0.35)
  Top 0.457: R8.2 32.07,16.83 14.54,16.83 C12.- 12.64,16.26 11.11,17.78 9.53,17.78 7.94,19.37 7.94,41.27 v11.75,45.09
  Bottom 0.457: C2.+ 23.88,45.09 v11.75,45.09
RX1  (via drill 0.35)
  Top 0.457: U$8.TX 115.57,19.69 113.35,17.46 93.66,17.46 v92.71,16.51
  Bottom 0.457: v92.71,16.51 91.76,16.51 91.1,15.85 75.55,15.85 72.64,18.76 68.96,18.76 67.31,20.41 67.31,38.42 66.36,39.37 U$1.P$31
S0  (via drill 0.35)
  Top 0.457: v47.31,16.83 78.74,16.83 v81.28,19.37 | v85.09,36.83 85.41,37.15 91.76,37.15 93.98,39.37 U$5.S0
  Bottom 0.457: U$1.P$16 37.47,57.79 37.47,20 40.64,16.83 v47.31,16.83 | v81.28,19.37 81.28,22.86 79.03,25.11 72.45,25.11 71.14,26.42 71.14,31.69 75.31,35.85 76.81,35.85 77.79,36.83 v85.09,36.83
S1  (via drill 0.35)
  Top 0.457: v47.31,15.24 79.06,15.24 v82.55,18.73
  Bottom 0.457: U$1.P$17 36.51,59.37 36.51,19.05 40.32,15.24 v47.31,15.24 | v82.55,18.73 82.55,23.49 80.33,25.72 72.71,25.72 71.75,26.67 71.75,31.43 75.56,35.24 87.63,35.24 91.44,39.05 U$5.S1
S2
  Top 0.457: U$1.P$27 66.04,49.53 71.44,44.13 87.95,44.13 88.9,43.18 U$5.S2
S3
  Top 0.457: U$1.P$28 66.99,46.99 73.98,40.01 84.45,40.01 86.36,41.91 U$5.S3
SCL
  Bottom 0.61: X1.2 14.61,80.96 16.19,82.55 56.83,82.55 60.33,79.06 60.33,64.45 62.55,62.23 U$1.P$22 66.67,62.23 68.26,63.82 68.26,65.09 69.22,66.04 U2.3
SDA
  Bottom 0.457: U$1.P$25 66.04,54.61 68.26,56.83 68.26,62.23 69.53,63.5 U2.4
  Bottom 0.61: X1.3 17.14,80.33 18.41,81.6 56.52,81.6 59.37,78.74 59.37,57.15 61.91,54.61 U$1.P$25
SG1_IN  (via drill 0.35)
  Top 0.457: U3.6 17.78,43.81 22.86,48.89 U4.1 | VR2.2 34.61,18.73 78.74,18.73 83.5,23.49 v106.36,23.49
  Bottom 0.457: VR2.2 29.84,21.91 27.94,20 12.7,20 10.16,22.54 10.16,34.29 11.75,35.88 16.03,35.88 U3.6 | v106.36,23.49 106.36,27.12 U$5.C2
SG3_IN  (via drill 0.35)
  Top 0.457: U4.7 24.13,59.05 24.77,58.42 26.67,58.42 28.89,56.2 28.89,52.71 v27.3,51.12 | U1.6 31.11,36.51 35.56,32.07 35.56,28.57 34.29,27.3 v34.13,27.46 | v47.31,13.02 80.01,13.02 v84.77,17.78
  Bottom 0.457: VR1.2 16.51,25.4 17.46,26.35 21.59,26.35 23.18,27.94 23.18,31.75 24.13,32.7 26.67,32.7 31.11,37.15 U1.6 29.21,39.53 29.21,44.13 30.48,45.4 30.48,50.16 29.53,51.12 v27.3,51.12 | v34.13,27.46 34.13,19.53 40.64,13.02 v47.31,13.02 | v84.77,17.78 85.09,18.1 97.79,18.1 104.14,24.45 U$5.C3
SW_PREAMP
  Top 0.254: R7.2 19.37,2.86 21.91,2.86 22.54,3.49 IC1.3
TX1  (via drill 0.35)
  Top 0.457: U$8.RX 114.62,22.23 113.98,21.59 113.98,19.69 113.35,19.05 91.76,19.05 v89.53,16.83
  Bottom 0.457: v89.53,16.83 86.04,16.83 85.67,16.46 75.93,16.46 73.03,19.37 69.22,19.37 68.26,20.32 68.26,40.64 66.99,41.91 U$1.P$30
V_ESP32
  Bottom 0.61: U$3.P$3 65.72,3.49 47.62,21.59 U$1.P$1
V_POT  (via drill 0.35)
  Top 0.457: v47.62,53.66 56.2,62.23 56.2,66.99 60.01,70.8 67.94,70.8 68.9,69.85 68.9,57.15 70.17,55.88 U2.7
  Bottom 0.457: R15.2 12.7,53.66 26.35,53.66 35.56,62.87 35.56,78.42 36.83,79.69 47.62,79.69 49.85,77.47 49.85,54.29 49.21,53.66 v47.62,53.66
WAV_FIXED  (via drill 0.35)
  Top 0.457: U6.6 98.11,83.19 99.38,81.91 102.55,81.91 103.82,83.19 107,83.19 107.95,82.23 VR6.2 | C13.+ 121.22,38.8 120.02,40.01 117.79,40.01 v117.47,39.69
  Bottom 0.457: v117.47,39.69 120.33,42.55 120.97,42.55 121.28,42.86 121.28,45.72 115.89,51.12 115.89,58.42 113.03,61.28 113.03,71.75 107.95,76.84 VR6.2
WAV_OUT  (via drill 0.35)
  Top 0.457: U$8.SPK1 126.68,12.06 128.91,14.29 128.91,32.7 125.41,36.2 124.14,36.2 123.19,37.15 123.19,39.69 125.41,41.91 126.68,41.91 127.95,43.18 v127.95,47.94
  Bottom 0.457: v127.95,47.94 129.54,49.53 130.18,49.53 130.81,50.16 130.81,54.93 126.68,59.05 126.68,72.71 125.09,74.29 119.06,74.29 117.54,75.82 C14.+
WS2812
  Bottom 0.61: X2.2 32.38,80.65 49.21,80.65 51.12,78.74 51.12,40.32 59.69,31.75 U$1.P$34

### Text on the board
tNames: AUDIO INPUT | SCREEN | LED STRIP | ENCODER | MOTOR | -12V GND+12V | AUDIO OUTPUT | FM SENS | INTERN GAIN | INPUT GAIN | GATE | COMP